# EAGLE design main_pcb (EAGLE 9.3.1)
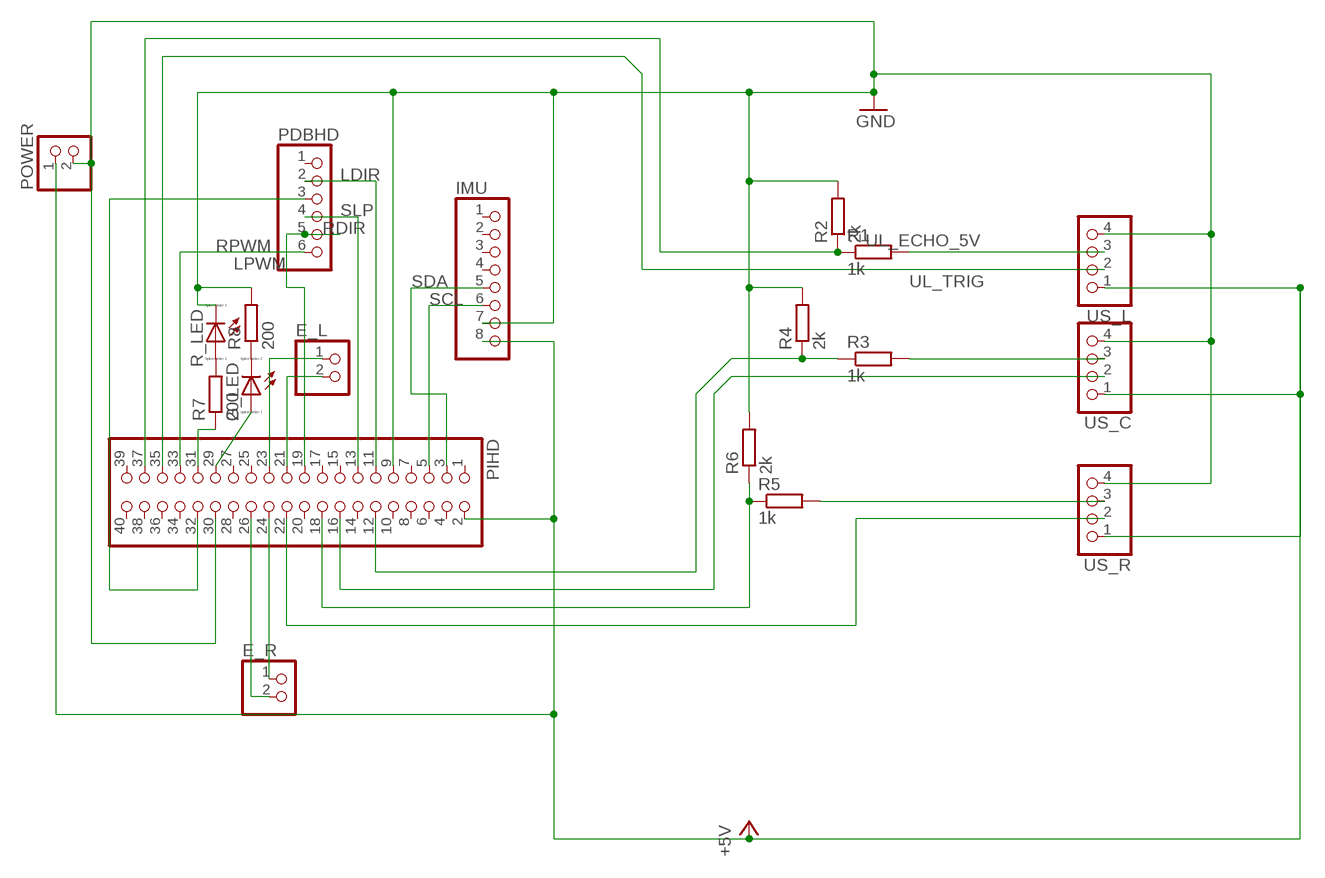
[diagram p0: schematic, sheet 1]

## Parts
E_L  PINHD-1X2  [1X02]
E_R  PINHD-1X2  [1X02]
G_LED  LED_ELD260  [LED_LD260]
IMU  PINHD-1X8  [1X08]
PDBHD  PINHD-1X6  [1X06]
PIHD  PINHD-2X20  [2X20]
POWER  PINHD-1X2  [1X02]
R1  1k  R-EU_0207/10  [0207/10]
R2  2k  R-EU_0207/10  [0207/10]
R3  1k  R-EU_0207/10  [0207/10]
R4  2k  R-EU_0207/10  [0207/10]
R5  1k  R-EU_0207/10  [0207/10]
R6  2k  R-EU_0207/10  [0207/10]
R7  200  R-EU_0207/10  [0207/10]
R8  200  R-EU_0207/10  [0207/10]
R_LED  LED_ELD260  [LED_LD260]
US_C  PINHD-1X4  [1X04]
US_L  PINHD-1X4  [1X04]
US_R  PINHD-1X4  [1X04]

## Nets
+5V: IMU.8 PIHD.2 POWER.1 US_C.1 US_L.1 US_R.1
ER_A: E_R.1 PIHD.24
ER_B: E_R.2 PIHD.26
GND: IMU.7 PIHD.9 PIHD.30 POWER.2 R2.2 R4.2 R6.2 R8.2 R_LED.K(C) US_C.4 US_L.4 US_R.4
LDIR: PDBHD.2 PIHD.11
LED_G: G_LED.A PIHD.29
LED_R: PIHD.31 R7.1
LPWM: PDBHD.3 PIHD.32
N$1: E_L.2 PIHD.21
N$2: E_L.1 PIHD.23
N$8: R7.2 R_LED.A
N$11: G_LED.K(C) R8.1
RDIR: PDBHD.5 PIHD.19
RPWM: PDBHD.6 PIHD.33
SCL: IMU.6 PIHD.5
SDA: IMU.5 PIHD.3
SLP: PDBHD.4 PIHD.13
UC_ECHO: PIHD.12 R3.1 R4.1
UC_ECHO_5V: R3.2 US_C.3
UC_TRIG: PIHD.16 US_C.2
UL_ECHO: PIHD.37 R1.1 R2.1
UL_ECHO_5V: R1.2 US_L.3
UL_TRIG: PIHD.35 US_L.2
UR_ECHO: PIHD.18 R5.1 R6.1
UR_ECHO_5V: R5.2 US_R.3
UR_TRIG: PIHD.22 US_R.2
Unconnected: IMU.1 IMU.2 IMU.3 IMU.4 PDBHD.1 PIHD.1 PIHD.4 PIHD.6 PIHD.7 PIHD.8 PIHD.10 PIHD.14 PIHD.15 PIHD.17 PIHD.20 PIHD.25 PIHD.27 PIHD.28 PIHD.34 PIHD.36 PIHD.38 PIHD.39 PIHD.40

## Library data of the parts
E_L E_R POWER = pinhead:PINHD-1X2: PIN HEADER
G_LED R_LED = eagle-ltspice:LED_E: LED Source: http://www.osram.convergy.de Source: www.luxeon.com Source: www.kingbright.com; SPICEMODEL: NONE; SPICEPREFIX: D; SPICETYPE: diode
IMU = pinhead:PINHD-1X8: PIN HEADER
PDBHD = pinhead:PINHD-1X6: PIN HEADER
PIHD = pinhead:PINHD-2X20: PIN HEADER
R1-R8 = rcl:R-EU_: RESISTOR, European symbol
US_C US_L US_R = pinhead:PINHD-1X4: PIN HEADER

## Board
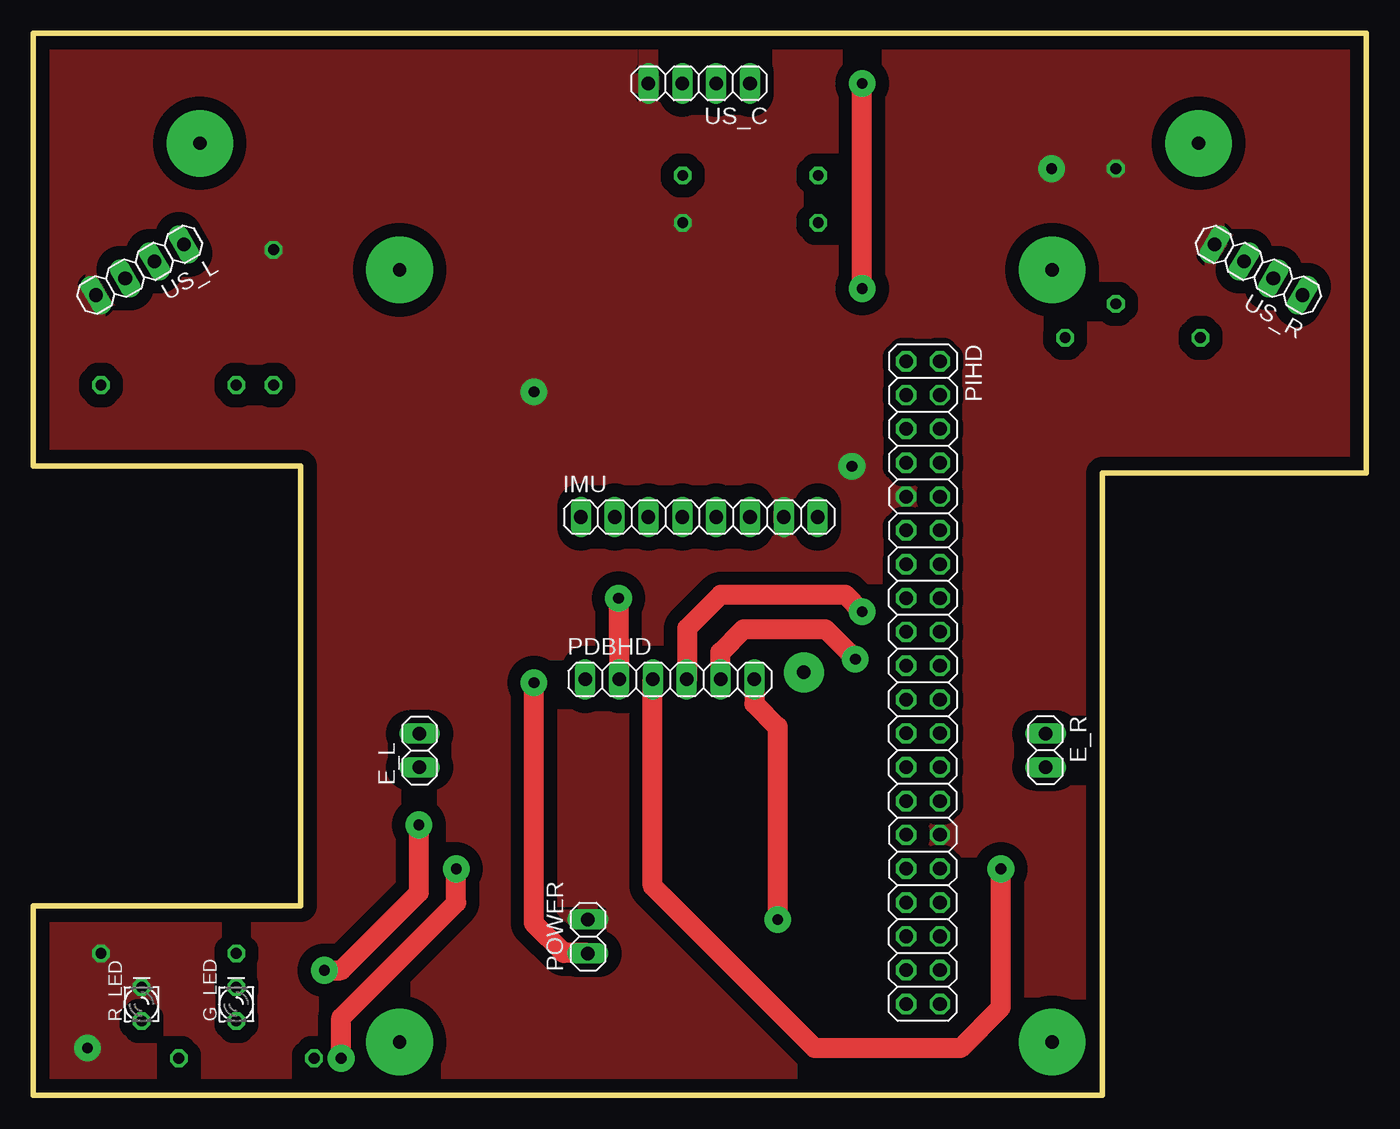
[diagram p1: board, top side]
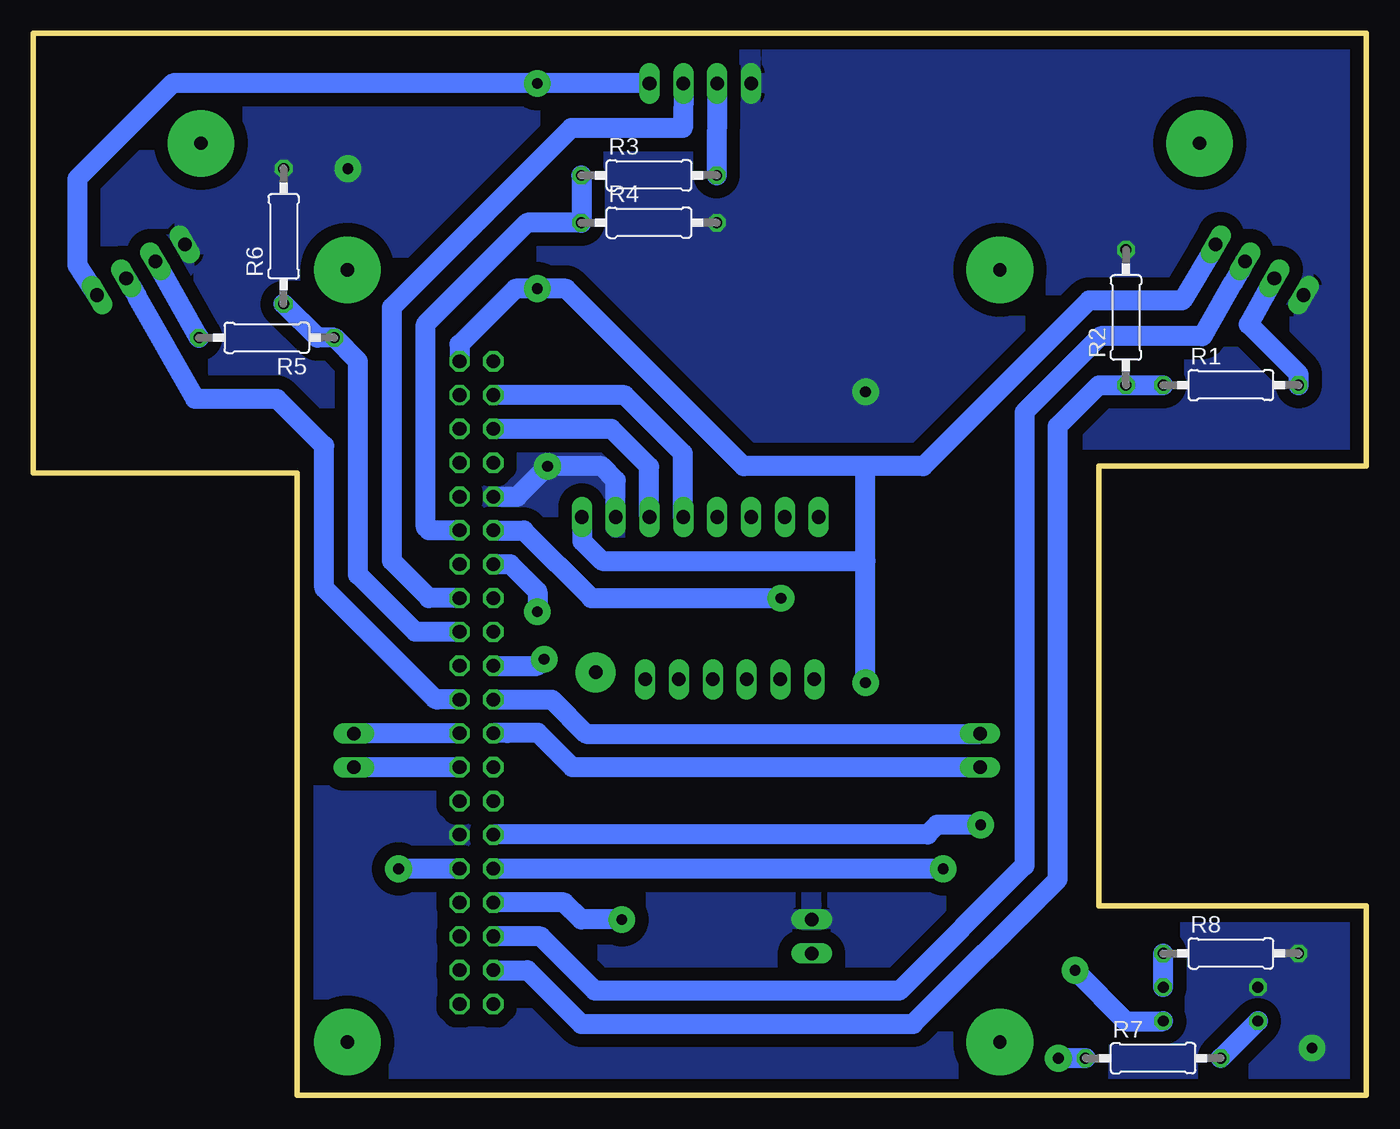
[diagram p2: board, bottom side, seen from below]

Size 100.08 x 79.76 mm. Coordinates in mm from the lower left corner, seen from the top.
Outline: 20.07,47.24 0,47.24 0,79.76 100.08,79.76 100.08,46.74 80.26,46.74 80.26,0 0,0 0,14.22 20.07,14.22 20.07,47.24
Copper layers (1*16): Top 0.035mm / dielectric 1.5mm / Bottom 0.035mm
Design rules "default *": minimum track width 1.5mm, minimum drill 0.8mm, track to track 1mm, track to pad 1mm, pad to pad 1mm, via to via 1mm, smd to smd 8mil, copper to edge 40mil, drill to drill 0.8mm, minimum pad ring 10mil, minimum via ring 8mil, stop-mask expansion 4mil, vias tented up to drill 0mil, thermal gap 10mil

### Footprints (pad centres in the part's own frame; a part is rotated, then mirrored left to right if it is on the bottom)
1X02 = drill 1.016 long: 1 -1.27,0; 2 1.27,0
LED_LD260 = drill 0.813 octagon: A -1.27,0; K 1.27,0
1X08 = drill 1.016 long: 1 -8.89,0; 2 -6.35,0; 3 -3.81,0; 4 -1.27,0; 5 1.27,0; 6 3.81,0; 7 6.35,0; 8 8.89,0
1X06 = drill 1.016 long: 1 -6.35,0; 2 -3.81,0; 3 -1.27,0; 4 1.27,0; 5 3.81,0; 6 6.35,0
2X20 = drill 1.016 octagon: 1 -24.13,-1.27; 2 -24.13,1.27; 3 -21.59,-1.27; 4 -21.59,1.27; 5 -19.05,-1.27; 6 -19.05,1.27; 7 -16.51,-1.27; 8 -16.51,1.27; 9 -13.97,-1.27; 10 -13.97,1.27; 11 -11.43,-1.27; 12 -11.43,1.27; 13 -8.89,-1.27; 14 -8.89,1.27; 15 -6.35,-1.27; 16 -6.35,1.27; 17 -3.81,-1.27; 18 -3.81,1.27; 19 -1.27,-1.27; 20 -1.27,1.27; 21 1.27,-1.27; 22 1.27,1.27; 23 3.81,-1.27; 24 3.81,1.27; 25 6.35,-1.27; 26 6.35,1.27; 27 8.89,-1.27; 28 8.89,1.27; 29 11.43,-1.27; 30 11.43,1.27; 31 13.97,-1.27; 32 13.97,1.27; 33 16.51,-1.27; 34 16.51,1.27; 35 19.05,-1.27; 36 19.05,1.27; 37 21.59,-1.27; 38 21.59,1.27; 39 24.13,-1.27; 40 24.13,1.27
0207/10 = drill 0.813 octagon: 1 -5.08,0; 2 5.08,0
1X04 = drill 1.016 long: 1 -3.81,0; 2 -1.27,0; 3 1.27,0; 4 3.81,0

### Placement (x,y rotation side)
E_L  29,25.91 90 top
E_R  76,25.91 270 top
G_LED  15.24,6.86 90 top
IMU  50,43.43 0 top
PDBHD  47.79,31.24 0 top
PIHD  66.8,31 270 top
POWER  41.64,11.94 90 top
R1  10.16,53.34 0 bottom
R2  18.03,58.42 90 bottom
R3  53.85,69.09 0 bottom
R4  53.85,65.53 0 bottom
R5  82.55,56.9 180 bottom
R6  81.28,64.52 90 bottom
R7  16,2.79 0 bottom
R8  10.16,10.67 0 bottom
R_LED  8.13,6.86 90 top
US_C  50,76 180 top
US_L  8,62 210 top
US_R  92,62 150 top

### Tracks (layer width: path | path; a pad name or v marks a point on that pad's centre or on a via)
+5V  (via drill 0.8 pad 2)
  Top 1.5: POWER.1 41.61,10.7 39.84,10.7 37.59,12.94 v37.59,30.99 | v62.23,60.58 v62.23,76
  Bottom 1.5: US_R.1 96.77,62.34 96.77,68.83 89.61,76 v62.23,76 US_C.1 | v37.59,30.99 37.59,40.13 | 37.59,40.13 37.59,47.24 | US_L.1 13.81,59.69 20.81,59.69 33.25,47.24 37.59,47.24 | IMU.8 58.86,43.24 58.86,41.63 57.36,40.13 37.59,40.13 | PIHD.2 68.07,56.39 63.88,60.58 v62.23,60.58 60.07,60.58 46.74,47.24 37.59,47.24
ER_A
  Bottom 1.5: PIHD.24 75.92,27.19 E_R.1
ER_B
  Bottom 1.5: PIHD.26 75.92,24.65 E_R.2
GND  (via drill 0.8 pad 2)
  Bottom 1.5: PIHD.9 63.74,44.97 v61.47,47.24 57.4,47.24 56.35,46.19 IMU.7
  other vias: 37.59,52.83 76.45,69.6 4.06,3.56
  pour Bottom: 0,79.5 100.08,79.5 100.08,46.74 80.52,46.74 80.52,46.48 80.26,46.48 80.26,0 0.25,0 0.25,14.22 20.07,14.22 20.07,13.97 20.32,47.24 0,47.24
  pour Top: 0,79.76 100.08,79.76 100.08,46.74 80.26,46.74 80.26,0 0,0 0,14.22 20.07,14.22 20.07,47.24 0,47.24
LDIR  (via drill 0.8 pad 2)
  Top 1.5: v43.94,37.34 PDBHD.2
  Bottom 1.5: PIHD.11 63.26,42.43 58.17,37.34 v43.94,37.34
LED_G  (via drill 0.8 pad 2)
  Top 1.5: v28.96,20.32 28.96,15.24 23.11,9.4 v21.84,9.4
  Bottom 1.5: v21.84,9.4 18.03,5.59 G_LED.A | v28.96,20.32 32.22,20.32 32.94,19.6 65.5,19.6 PIHD.29
LED_R  (via drill 0.8 pad 2)
  Top 1.5: v23.11,2.79 23.11,5.84 31.75,14.48 v31.75,17.02
  Bottom 1.5: R7.1 v23.11,2.79 | v31.75,17.02 65.52,17.02 PIHD.31
LPWM  (via drill 0.8 pad 2)
  Top 1.5: v72.64,17.02 72.64,6.6 69.6,3.56 58.67,3.56 46.5,15.73 46.5,31.24 PDBHD.3
  Bottom 1.5: PIHD.32 68.08,17.02 v72.64,17.02
N$1
  Bottom 1.5: PIHD.21 61.14,29.73 58.57,27.15 28.97,27.15 | 28.45,27.15 28.97,27.15 | 28.97,27.15 E_L.2
N$2
  Bottom 1.5: E_L.1 59.59,24.64 62.18,27.23 64.48,27.23 64.49,27.22 65.5,27.22 PIHD.23
N$8
  Bottom 1.5: R7.2 R_LED.A
N$11
  Bottom 1.5: G_LED.K R8.1
RDIR  (via drill 0.8 pad 2)
  Top 1.5: PDBHD.5 51.59,31.25 51.59,33.27 53.34,35.02 59.46,35.02 v61.72,32.77
  Bottom 1.5: v61.72,32.77 62.23,32.26 65.52,32.26 PIHD.19
RPWM  (via drill 0.8 pad 2)
  Top 1.5: PDBHD.6 54.14,29.43 55.88,27.69 v55.88,13.21
  Bottom 1.5: v55.88,13.21 58.93,13.21 60.21,14.49 PIHD.33
SCL
  Bottom 1.5: IMU.6 53.84,43.46 53.84,47.21 56.67,50.05 PIHD.5
SDA
  Bottom 1.5: IMU.5 51.3,43.46 51.3,48.21 55.68,52.59 PIHD.3
SLP  (via drill 0.8 pad 2)
  Top 1.5: PDBHD.4 49.09,31.27 49.09,35.08 51.6,37.59 60.96,37.59 v62.23,36.32
  Bottom 1.5: v62.23,36.32 62.23,37.85 64.27,39.89 PIHD.13
SPACER_IMU  (via drill 1 pad 3)
  other vias: 57.85,31.77
SPACER_PCB_L  (via drill 1 pad 5)
  other vias: 12.5,71.5
SPACER_PCB_R  (via drill 1 pad 5)
  other vias: 87.5,71.5
SPACER_RPI_BL  (via drill 1 pad 5)
  other vias: 27.5,4
SPACER_RPI_BR  (via drill 1 pad 5)
  other vias: 76.5,4
SPACER_RPI_FL  (via drill 1 pad 5)
  other vias: 27.5,62
SPACER_RPI_FR  (via drill 1 pad 5)
  other vias: 76.5,62
UC_ECHO
  Bottom 1.5: R3.1 R4.1 62.99,65.53 70.61,57.91 70.61,42.68 70.37,42.43 PIHD.12
UC_ECHO_5V
  Bottom 1.5: US_C.3 R3.2
UC_TRIG
  Bottom 1.5: US_C.2 51.31,72.64 59.69,72.64 73.15,59.18 73.15,40.13 70.37,37.35 PIHD.16
UL_ECHO
  Bottom 1.5: R1.1 R2.1 20.07,53.34 23.15,50.25 23.15,16.24 34.02,5.37 58.95,5.37 62.98,9.41 PIHD.37
UL_ECHO_5V
  Bottom 1.5: US_L.3 8.83,57.91 5.08,54.16 R1.2
UL_TRIG
  Bottom 1.5: US_L.2 9.55,61.8 9.98,61.06 12.23,57.09 12.31,57.01 19.95,57.01 25.65,51.31 25.65,17.27 35.05,7.87 57.91,7.87 61.98,11.94 65.52,11.94 PIHD.35
UR_ECHO
  Bottom 1.5: R6.1 78.74,56.9 R5.1 75.69,55.12 75.69,39.12 71.39,34.81 PIHD.18
UR_ECHO_5V
  Bottom 1.5: US_R.3 87.65,56.91 R5.2
UR_TRIG
  Bottom 1.5: US_R.2 92.47,60.33 92.3,60.03 87.93,52.32 81.79,52.32 78.23,48.77 78.23,38.1 69.94,29.81 69.73,29.73 PIHD.22